# Altium schematic sheet RK3562-VCCIO1.SchDoc
size 297 x 209 mm; SheetNumber: 7; SheetTotal: 32
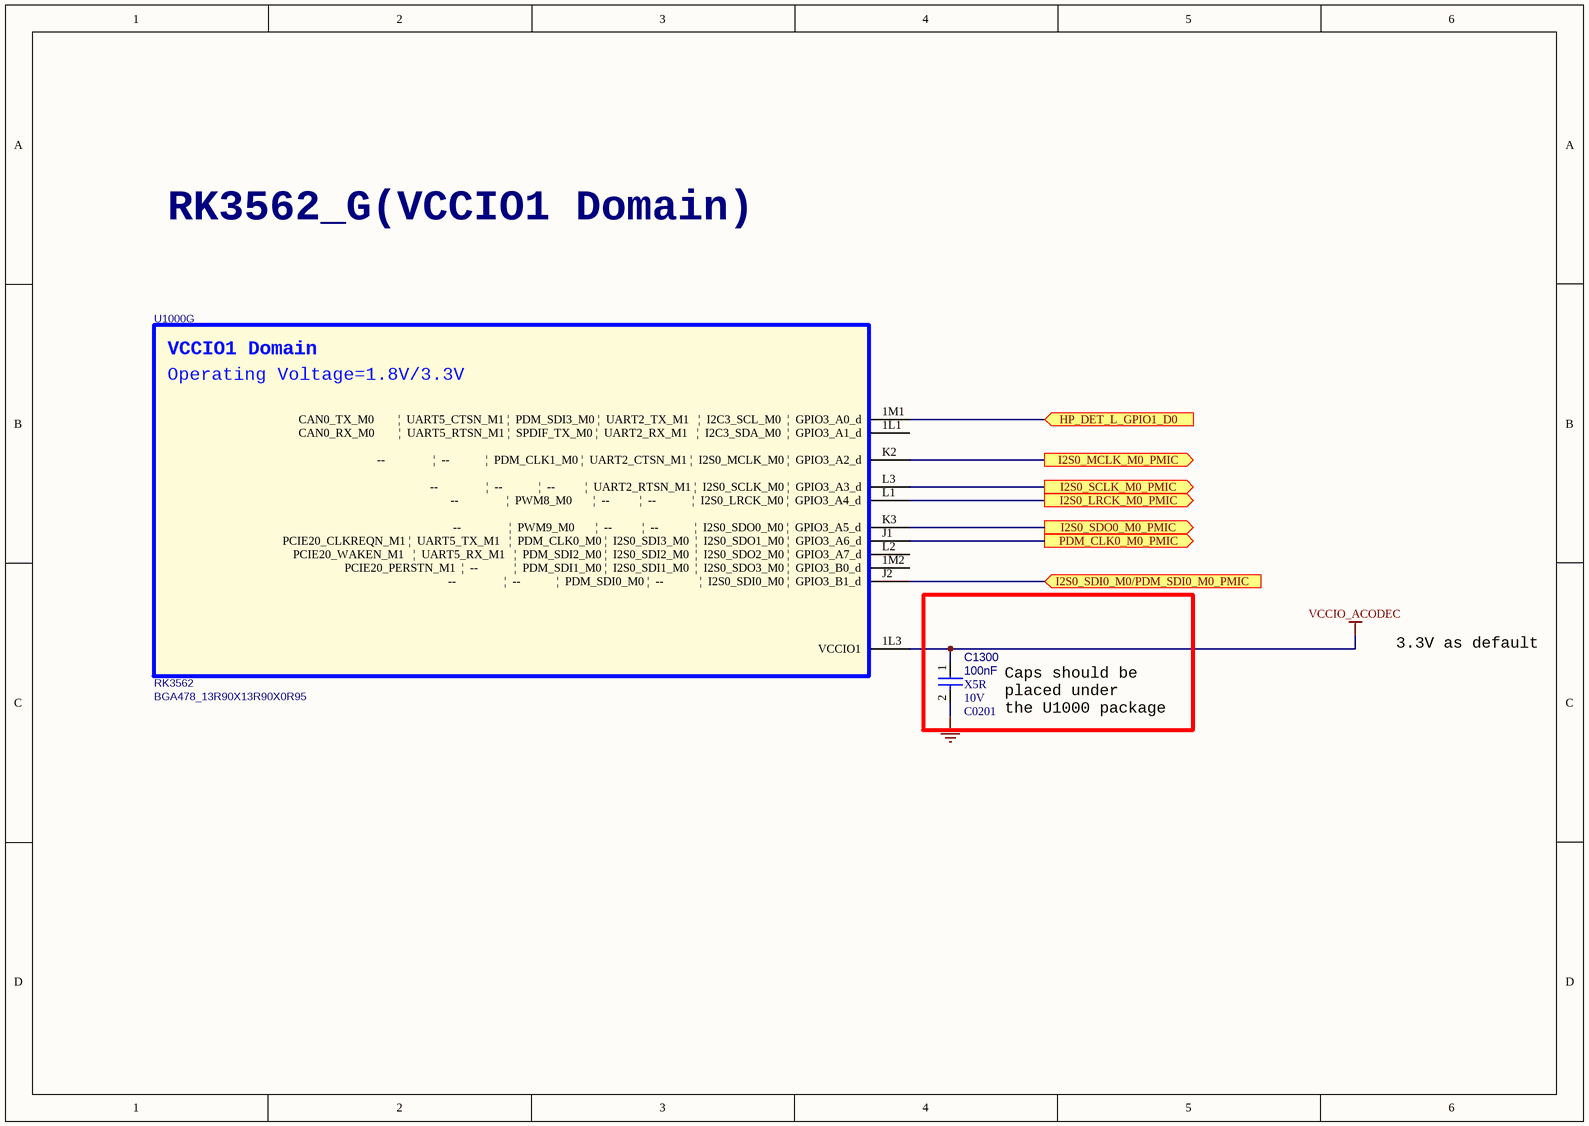
[diagram p0: RK3562-VCCIO1.SchDoc]

## Parts
C1300  100nF  Dielectric: X5R  Voltage: 10V  [C0201]
U1000  RK3562  [BGA478_13R90X13R90X0R95]  (part G of 16)

## Ports
HP_DET_L_GPIO1_D0 (in, see CONTROLLER-RK3562[4A]), I2S0_LRCK_M0_PMIC (out, see CONTROLLER-RK3562[4A], RK-POWER-SUPPLY[3A]), I2S0_MCLK_M0_PMIC (out, see CONTROLLER-RK3562[4A], RK-POWER-SUPPLY[3A]), I2S0_SCLK_M0_PMIC (out, see CONTROLLER-RK3562[4A], RK-POWER-SUPPLY[3A]), I2S0_SDI0_M0/PDM_SDI0_M0_PMIC (in, see CONTROLLER-RK3562[4A], RK-POWER-SUPPLY[3A]), I2S0_SDO0_M0_PMIC (out, see CONTROLLER-RK3562[4A], RK-POWER-SUPPLY[3A]), PDM_CLK0_M0_PMIC (out, see CONTROLLER-RK3562[4A], RK-POWER-SUPPLY[3A])

## Nets
GND: C1300.2
VCCIO_ACODEC: C1300.1 U1000.1L3(VCCIO1)
HP_DET_L_GPIO1_D0: U1000.1M1(CAN0_TX_M0________|__UART5_CTSN_M1_|__PDM_SDI3_M0_|__UART2_TX_M1___|__I2C3_SCL_M0__|__GPIO3_A0_d) ; port HP_DET_L_GPIO1_D0
I2S0_LRCK_M0_PMIC: U1000.L1(--________________|__PWM8_M0_______|__--__________|__--____________|__I2S0_LRCK_M0_|__GPIO3_A4_d) ; port I2S0_LRCK_M0_PMIC
I2S0_MCLK_M0_PMIC: U1000.K2(--________________|__--____________|__PDM_CLK1_M0_|__UART2_CTSN_M1_|__I2S0_MCLK_M0_|__GPIO3_A2_d) ; port I2S0_MCLK_M0_PMIC
I2S0_SCLK_M0_PMIC: U1000.L3(--________________|__--____________|__--__________|__UART2_RTSN_M1_|__I2S0_SCLK_M0_|__GPIO3_A3_d) ; port I2S0_SCLK_M0_PMIC
I2S0_SDI0_M0/PDM_SDI0_M0_PMIC: U1000.J2(--________________|__--____________|__PDM_SDI0_M0_|__--____________|__I2S0_SDI0_M0_|__GPIO3_B1_d) ; port I2S0_SDI0_M0/PDM_SDI0_M0_PMIC
I2S0_SDO0_M0_PMIC: U1000.K3(--________________|__PWM9_M0_______|__--__________|__--____________|__I2S0_SDO0_M0_|__GPIO3_A5_d) ; port I2S0_SDO0_M0_PMIC
PDM_CLK0_M0_PMIC: U1000.J1(PCIE20_CLKREQN_M1_|__UART5_TX_M1___|__PDM_CLK0_M0_|__I2S0_SDI3_M0__|__I2S0_SDO1_M0_|__GPIO3_A6_d) ; port PDM_CLK0_M0_PMIC

Not connected (* = marked no-connect by the designer): U1000 1L1(CAN0_RX_M0________|__UART5_RTSN_M1_|__SPDIF_TX_M0_|__UART2_RX_M1___|__I2C3_SDA_M0__|__GPIO3_A1_d) 1M2(PCIE20_PERSTN_M1__|__--____________|__PDM_SDI1_M0_|__I2S0_SDI1_M0__|__I2S0_SDO3_M0_|__GPIO3_B0_d) L2(PCIE20_WAKEN_M1___|__UART5_RX_M1___|__PDM_SDI2_M0_|__I2S0_SDI2_M0__|__I2S0_SDO2_M0_|__GPIO3_A7_d)

## Notes on the sheet
- RK3562_G(VCCIO1 Domain)
- 3.3V as default
- Caps should be
  placed under
  the U1000 package
- (in symbol SOC_RK3562, part G) VCCIO1 Domain; Operating Voltage=1.8V/3.3V

## Library data of the parts
C1300 = CAP NP: cap,100.00nF,+/-10%,10V,X5R,C0201; Part Reference: C1300; Manufacturer: TDK; RK PN: C0603X5R1A104K030BC; Priority: A; Tolerance: 10%; PCB Footprint: C0201; Value: 100nF; Part Type: C0201; Manufacturer PN: C0603X5R1A104K030BC; Created by: JJJ; ClassName: RK
U1000 = SOC_RK3562: ROCKCHIP SOC; Part Reference: U1000; Manufacturer: Rockchip (瑞芯微); SPLIT_INST: TRUE; SWAP_INFO: (S1+S2+S3+S4+S5+S6+S7+S8+S9+S10+S11+S12+S13+S14+S15+S16); RK PN: 906000425; Priority: A; PCB Footprint: BGA478_13R90X13R90X0R95; Value: RK3562; Part Type: SOC; Manufacturer PN: RK3562; Created by: JJJ; ClassName: RK